# Altium schematic sheet USB2Serial.SchDoc
size A4; SheetNumber: 5; SheetTotal: 7
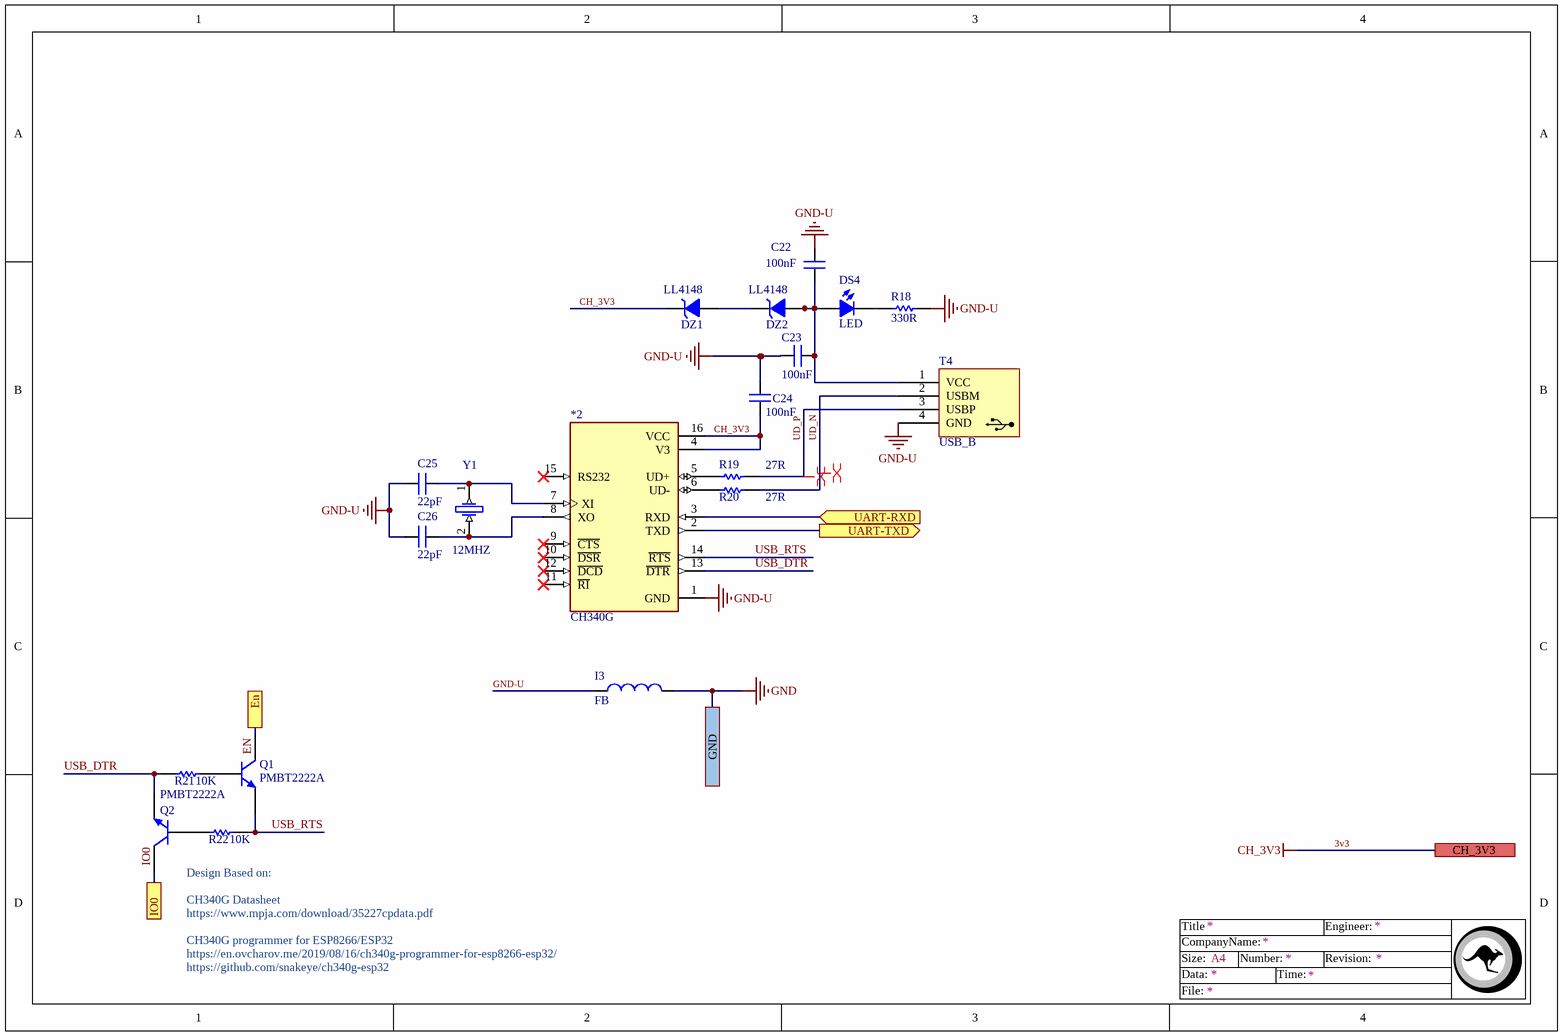
[diagram p0: USB2Serial.SchDoc]

## Parts
*2  CH340G  [SOIC127P600X180-16N]
C22  100nF  [Cap0805]
C23  100nF  [Cap0805]
C24  100nF  [Cap0805]
C25  22pF  [Cap0805]
C26  22pF  [Cap0805]
DS4  LED  [LED_0805Green]
DZ1  LL4148  [LL4148]
DZ2  LL4148  [LL4148]
I3  FB  [1206]
Q1  PMBT2222A  [SOT23_BEC_N]
Q2  PMBT2222A  [SOT23_BEC_N]
R18  330R  [R0805]
R19  27R  [R0805]
R20  27R  [R0805]
R21  10K  [R0805]
R22  10K  [R0805]
T4  USB_B  [USB_Dip_R]
Y1  12MHZ  [Crystal SMD]

## Ports
CH_3V3 (see Dashboard - Multifunctional Probe[4A]), En (see Dashboard - Multifunctional Probe[4A], Core-ESP32[2A]), GND (see Dashboard - Multifunctional Probe[4A], Core-ESP32[3D], Ethernet DP[3D], Input - Output[3D], Power Management[3D]), IO0 (see Dashboard - Multifunctional Probe[4A], Core-ESP32[3A]), UART-RXD (in, see Dashboard - Multifunctional Probe[4A], Core-ESP32[1B]), UART-TXD (out, see Dashboard - Multifunctional Probe[4A], Core-ESP32[1B])

## Nets
3v3: *2.4(V3) *2.16(VCC) C24.2 DZ1.K ; port CH_3V3  [also labelled CH_3V3]
GND: I3.2 ; port GND
GND-U: *2.1(GND) C22.2 C23.2 C24.1 C25.2 C26.2 I3.1 R18.1 T4.4(GND)
En: Q1.3(C) ; port En
IO0: Q2.3(C) ; port IO0
UART-RXD: *2.3(RXD) ; port UART-RXD
UART-TXD: *2.2(TXD) ; port UART-TXD
UD_N: R20.1 T4.2(USBM)
UD_P: R19.1 T4.3(USBP)
USB_DTR: *2.13(~{DTR}) Q2.2(E) R21.2
USB_RTS: *2.14(~{RTS}) Q1.2(E) R22.1
Net*2_5: *2.5(UD+) R19.2
Net*2_6: *2.6(UD-) R20.2
Net*2_7: *2.7(XI) C25.1 Y1.1
Net*2_8: *2.8(XO) C26.1 Y1.2
NetC22_1: C22.1 C23.1 DS4.A DZ2.A T4.1(VCC)
NetDS4_K: DS4.K R18.2
NetDZ1_A: DZ1.A DZ2.K
NetQ1_1: Q1.1(B) R21.1
NetQ2_1: Q2.1(B) R22.2

Not connected (* = marked no-connect by the designer): *2 9(~{CTS})* 10(~{DSR})* 11(~{RI})* 12(~{DCD})* 15(RS232)*

## Layout directives
differential pair: UD_N, UD_P

## Notes on the sheet
- Design Based on:
  CH340G Datasheet
  https://www.mpja.com/download/35227cpdata.pdf
  CH340G programmer for ESP8266/ESP32
  https://en.ovcharov.me/2019/08/16/ch340g-programmer-for-esp8266-esp32/
  https://github.com/snakeye/ch340g-esp32
- Labels drawn without touching a wire or pin: EN, IO0
- Title
- Size:
- Data:
- CompanyName:
- A4
- Number:
- Time:
- Revision:
- Engineer:
- File:

## Library data of the parts
C22-C26 = Cap: Surface mount Capacitor
DZ1 DZ2 = Diode Zener
I3 = Inductor: Indicator
Q1 Q2 = NPN: NPN Bipolar Transistor; Published: 8-Jun-2000; LatestRevisionDate: 29-May-2009; LatestRevisionNote: IPC-7351 Footprint Added.; PackageVersion: Aug-1999; PackageReference: SOT-23B; Publisher: Altium Limited; PackageDescription: 3-Pin SOT-23 Package 0.95 mm Pitch, 2.4 mm Lead Span
R18-R22 = Resistor
T4 = USB_B: USB B Connector
Y1 = Crystal